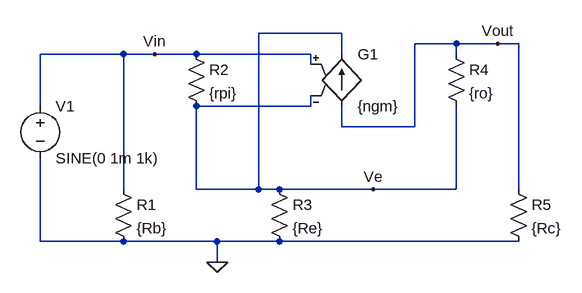
[diagram p0: schematic Draft1.asc]
Draft1.asc, the LTspice schematic file:
Version 4
SHEET 1 880 680
WIRE 432 128 304 128
WIRE 608 144 544 144
WIRE 672 144 608 144
WIRE 704 144 672 144
WIRE 96 160 -32 160
WIRE 144 160 96 160
WIRE 208 160 144 160
WIRE 384 160 208 160
WIRE 432 160 432 128
WIRE 608 160 608 144
WIRE 384 176 384 160
WIRE -32 240 -32 160
WIRE 384 240 384 224
WIRE 384 240 208 240
WIRE 432 272 432 240
WIRE 544 272 544 144
WIRE 544 272 432 272
WIRE 96 368 96 160
WIRE 208 368 208 240
WIRE 304 368 304 128
WIRE 304 368 208 368
WIRE 336 368 304 368
WIRE 480 368 336 368
WIRE 608 368 608 240
WIRE 608 368 480 368
WIRE 704 368 704 144
WIRE -32 448 -32 320
WIRE 96 448 -32 448
WIRE 240 448 96 448
WIRE 336 448 240 448
WIRE 704 448 336 448
WIRE 240 480 240 448
FLAG 240 480 0
FLAG 672 144 Vout
FLAG 480 368 Ve
FLAG 144 160 Vin
SYMBOL res 80 352 R0
SYMATTR InstName R1
SYMATTR Value {Rb}
SYMBOL res 192 144 R0
SYMATTR InstName R2
SYMATTR Value {rpi}
SYMBOL res 320 352 R0
SYMATTR InstName R3
SYMATTR Value {Re}
SYMBOL res 592 144 R0
SYMATTR InstName R4
SYMATTR Value {ro}
SYMBOL res 688 352 R0
SYMATTR InstName R5
SYMATTR Value {Rc}
SYMBOL g 432 144 R0
SYMATTR InstName G1
SYMATTR Value {ngm}
SYMBOL voltage -32 224 R0
SYMATTR InstName V1
SYMATTR Value SINE(0 1m 1k)

The netlist it stands for:
* Draft1.asc
R1 Vin 0 {Rb}
R2 Vin Ve {rpi}
R3 Ve 0 {Re}
R4 Vout Ve {ro}
R5 Vout 0 {Rc}
G1 Vout Ve Vin Ve {ngm}
V1 Vin 0 SINE(0 1m 1k)
.backanno
.end